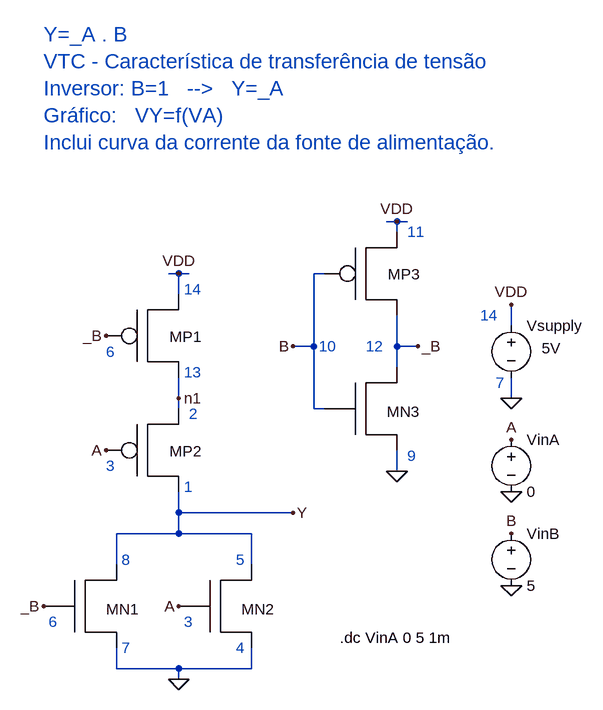
[diagram p0: schematic static-gate-VTC.asc]
static-gate-VTC.asc, the LTspice schematic file:
Version 4
SHEET 1 2472 680
WIRE 496 -96 480 -96
WIRE 512 -96 496 -96
WIRE 496 -80 496 -96
WIRE 160 -16 144 -16
WIRE 176 -16 160 -16
WIRE 384 -16 368 -16
WIRE 160 16 160 -16
WIRE 672 64 672 32
WIRE 368 96 368 -16
WIRE 368 96 336 96
WIRE 496 96 496 48
WIRE 528 96 496 96
WIRE 496 128 496 96
WIRE 160 176 160 144
WIRE 672 176 672 144
WIRE 160 192 160 176
WIRE 368 192 368 96
WIRE 384 192 368 192
WIRE 496 288 496 256
WIRE 160 352 160 320
WIRE 336 352 160 352
WIRE 160 384 160 352
WIRE 160 384 64 384
WIRE 272 384 160 384
WIRE 64 432 64 384
WIRE 272 432 272 384
WIRE 64 592 64 560
WIRE 160 592 64 592
WIRE 272 592 272 560
WIRE 272 592 160 592
WIRE 160 608 160 592
FLAG 672 176 0
FLAG 672 320 0
FLAG 672 464 0
FLAG 672 32 VDD
FLAG 672 240 A
FLAG 672 384 B
FLAG 496 -96 VDD
FLAG 336 96 B
FLAG 528 96 _B
FLAG 160 -16 VDD
FLAG 48 80 _B
FLAG -48 496 _B
FLAG 48 256 A
FLAG 160 496 A
FLAG 336 352 Y
FLAG 160 176 n1
FLAG 496 288 0
FLAG 160 608 0
SYMBOL voltage 672 48 R0
WINDOW 3 47 51 Left 2
SYMATTR Value 5V
SYMATTR InstName Vsupply
SYMBOL voltage 672 224 R0
WINDOW 123 0 0 Left 2
WINDOW 39 0 0 Left 2
SYMATTR InstName VinA
SYMATTR Value 0
SYMBOL voltage 672 368 R0
WINDOW 123 0 0 Left 2
WINDOW 39 0 0 Left 2
SYMATTR InstName VinB
SYMATTR Value 5
SYMBOL PMOSX 128 64 R0
SYMATTR InstName MP1
SYMBOL PMOSX 128 240 R0
SYMATTR InstName MP2
SYMBOL PMOSX 464 -32 R0
SYMATTR InstName MP3
SYMBOL NMOSX 32 480 R0
SYMATTR InstName MN1
SYMBOL NMOSX 240 480 R0
SYMATTR InstName MN2
SYMBOL NMOSX 464 176 R0
SYMATTR InstName MN3
TEXT 408 544 Left 2 !.dc VinA 0 5 1m
TEXT 624 48 Left 2 ;14
TEXT 648 152 Left 2 ;7
TEXT -48 -384 Left 3 ;Y=_A . B\nVTC - Característica de transferência de tensão\nInversor: B=1   -->   Y=_A\nGráfico:   VY=f(VA)\nInclui curva da corrente da fonte de alimentação.
TEXT 48 104 Left 2 ;6
TEXT -40 520 Left 2 ;6
TEXT 48 280 Left 2 ;3
TEXT 168 520 Left 2 ;3
TEXT 168 8 Left 2 ;14
TEXT 168 136 Left 2 ;13
TEXT 72 424 Left 2 ;8
TEXT 72 560 Left 2 ;7
TEXT 248 424 Left 2 ;5
TEXT 248 560 Left 2 ;4
TEXT 176 200 Left 2 ;2
TEXT 168 312 Left 2 ;1
TEXT 376 96 Left 2 ;10
TEXT 512 -80 Left 2 ;11
TEXT 448 96 Left 2 ;12
TEXT 512 264 Left 2 ;9

The netlist it stands for:
* static-gate-VTC.asc
Vsupply VDD 0 5V
VinA A 0 0
VinB B 0 5
XMP1 n1 _B VDD PMOSX  ; pins D G S
XMP2 Y A n1 PMOSX  ; pins D G S
XMP3 _B B VDD PMOSX  ; pins D G S
XMN1 Y _B 0 NMOSX  ; pins D G S
XMN2 Y A 0 NMOSX  ; pins D G S
XMN3 _B B 0 NMOSX  ; pins D G S
.dc VinA 0 5 1m
* 14
* 7
* Y=_A . B
* VTC - Característica de transferência de tensão
* Inversor: B=1   -->   Y=_A
* Gráfico:   VY=f(VA)
* Inclui curva da corrente da fonte de alimentação.
* 6
* 6
* 3
* 3
* 14
* 13
* 8
* 7
* 5
* 4
* 2
* 1
* 10
* 11
* 12
* 9
.lib MOS4007.txt
.backanno
.end